# Altium project TLE7181_breakout.PrjPcb
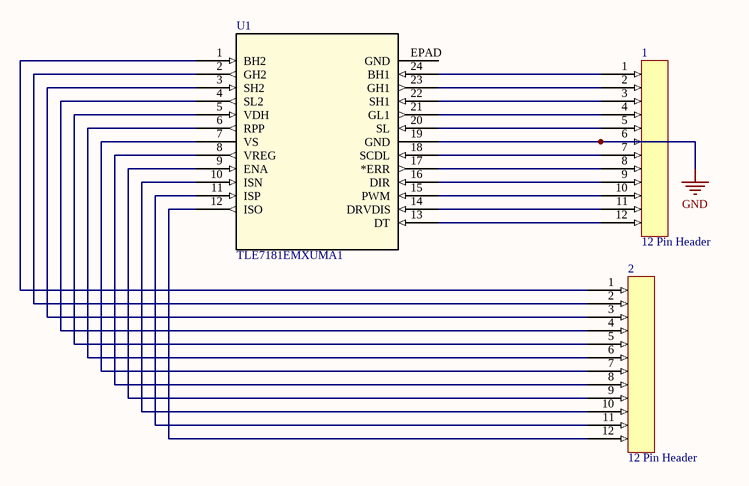
[diagram p0: Sheet1.SchDoc]
1 sheet, 3 parts. Net scope: global (net labels, ports and power ports of the same name join across sheets).
Board file: PCB1.PcbDoc

## Sheet Sheet1.SchDoc
size A; SheetNumber: 1; SheetTotal: 1

### Parts
1  12 Pin Header  [12 Pin Header-Footprint-1]
2  12 Pin Header  [12 Pin Header-Footprint-1]
U1  TLE7181EMXUMA1  [PG-SSOP-4_INF]

### Nets
GND: 1.6 U1.19(GND)
Net1_1: 1.1 U1.24(BH1)
Net1_2: 1.2 U1.23(GH1)
Net1_3: 1.3 U1.22(SH1)
Net1_4: 1.4 U1.21(GL1)
Net1_5: 1.5 U1.20(SL)
Net1_7: 1.7 U1.18(SCDL)
Net1_8: 1.8 U1.17(*ERR)
Net1_9: 1.9 U1.16(DIR)
Net1_10: 1.10 U1.15(PWM)
Net1_11: 1.11 U1.14(DRVDIS)
Net1_12: 1.12 U1.13(DT)
Net2_1: 2.1 U1.1(BH2)
Net2_2: 2.2 U1.2(GH2)
Net2_3: 2.3 U1.3(SH2)
Net2_4: 2.4 U1.4(SL2)
Net2_5: 2.5 U1.5(VDH)
Net2_6: 2.6 U1.6(RPP)
Net2_7: 2.7 U1.7(VS)
Net2_8: 2.8 U1.8(VREG)
Net2_9: 2.9 U1.9(ENA)
Net2_10: 2.10 U1.10(ISN)
Net2_11: 2.11 U1.11(ISP)
Net2_12: 2.12 U1.12(ISO)

Not connected (* = marked no-connect by the designer): U1 EPAD(GND)

### Library data of the parts
1 2 = CMP-002-00071-1: Gender: male; Pins: 12
U1 = TLE7181EMXUMA1: It incorporates several protection features such as over current and short circuit detection as well as under-, over voltage and over temperature diagnosis. Typical applications are fans, pumps and electric power steering. The MOTIXâ„¢ TLE7181EM is designed for a 12V power net.; Manufacturer_Name: Infineon; Copyright: Copyright (C) 2026 Ultra Librarian. All rights reserved.; Manufacturer_Part_Number: TLE7181EMXUMA1; Datasheet: https://www.infineon.com/dgdl/Infineon-TLE7181EM-DS-v01_01-en.pdf?fileId=db3a30432f5008fe012f5440330e3991; RefDes: RefDes; Type: Type